# EAGLE design vco_module (EAGLE 6.1)
AUTH: Jeremy Ruhland; LAST_DATE_TIME: 4/29/2014; VER: 1.0
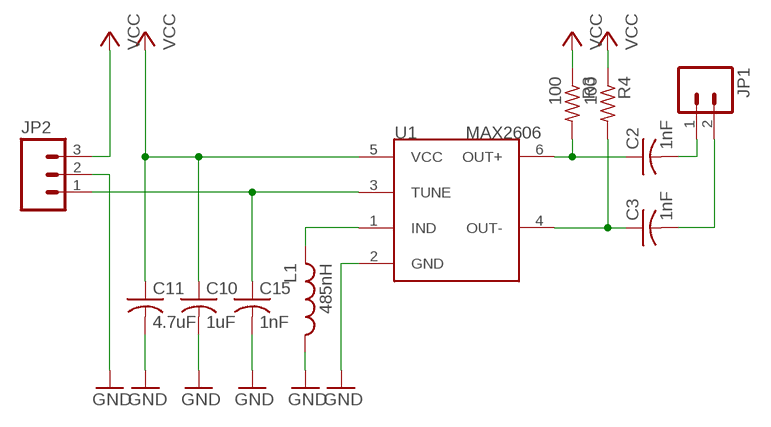
[diagram p0: schematic, sheet 1]

## Parts
C2  1nF  C-US050-025X075  [C050-025X075]
C3  1nF  C-US050-025X075  [C050-025X075]
C10  1uF  C-US050-025X075  [C050-025X075]
C11  4.7uF  C-US050-025X075  [C050-025X075]
C15  1nF  C-US050-025X075  [C050-025X075]
JP1  M023.5MM  [SCREWTERMINAL-3.5MM-2]
JP2  M03PTH  [1X03]
L1  485nH  L-US0204V  [0204V]
R3  100  R-US_0207/10  [0207/10]
R4  100  R-US_0207/10  [0207/10]
U1  MAX2606  [SOT23-6L]

## Nets
GND: C10.2 C11.2 C15.2 JP2.2 L1.1 U1.2(GND)
N$24: L1.2 U1.1(IND)
N$33: C2.1 R3.2 U1.6(OUT+)
N$35: C3.1 R4.2 U1.4(OUT-)
N$39: C2.2 JP1.1
N$52: C3.2 JP1.2
SIGNAL: C15.1 JP2.1 U1.3(TUNE)
VCC: C10.1 C11.1 JP2.3 R3.1 R4.1 U1.5(VCC)

## Library data of the parts
C2 C3 C10 C11 C15 = adafruit:C-US: CAPACITOR, American symbol
JP1 = sparkfun:M02: Header 2 Standard 2-pin 0.1" header. Use with straight break away headers (SKU : PRT-00116), right angle break away headers (PRT-00553), swiss pins (PRT-00743), machine pins (PRT-00117), and female headers (PRT-00115). Molex polarized connector foot print use with SKU : PRT-08233 with associated crimp pins and housings.
JP2 = sparkfun:M03: Header 3 Standard 3-pin 0.1" header. Use with straight break away headers (SKU : PRT-00116), right angle break away headers (PRT-00553), swiss pins (PRT-00743), machine pins (PRT-00117), and female headers (PRT-00115). Molex polarized connector foot print use with SKU : PRT-08232 with associated crimp pins and housings.
L1 = resistor:L-US: INDUCTOR, American symbol
R3 R4 = adafruit:R-US_: RESISTOR, American symbol
U1 = maxim:MAX2606

## Board
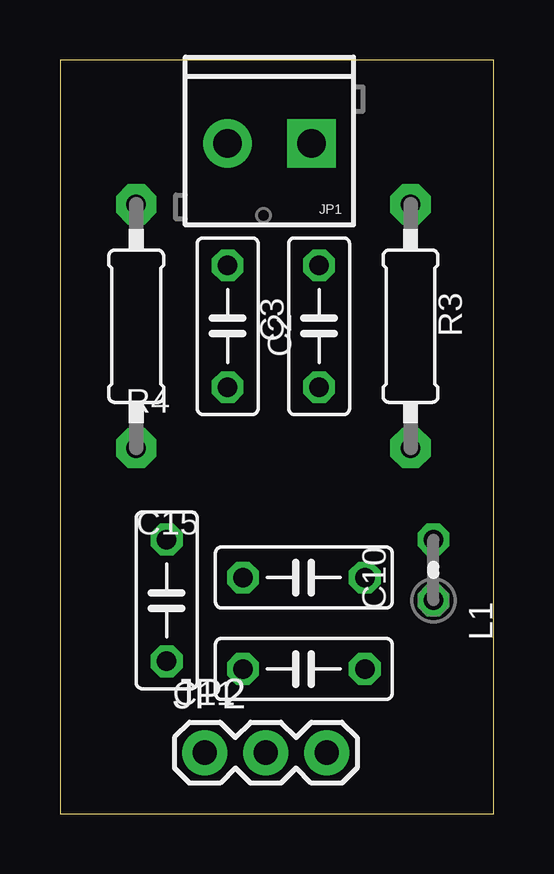
[diagram p1: board, top side]
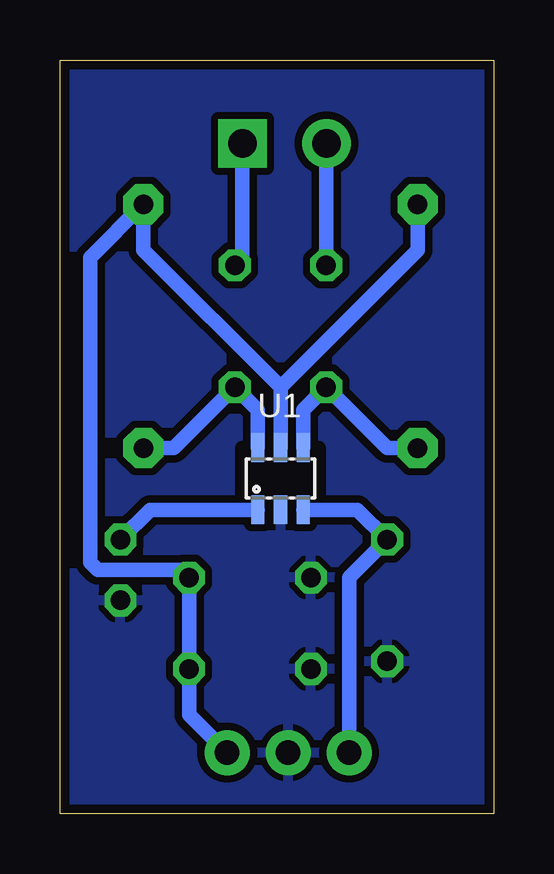
[diagram p2: board, bottom side, seen from below]

Size 18.08 x 31.42 mm. Coordinates in mm from the lower left corner, seen from the top.
Outline: 0,0 18.08,0 18.08,31.42 0,31.42 0,0
Copper layers (1*16): Top 0.035559375mm / dielectric 1.501140625mm / Bottom 0.035559375mm
Design rules: minimum track width 10mil, minimum drill 15mil, track to track 6mil, track to pad 6mil, pad to pad 6mil, via to via 6mil, smd to smd 6mil, copper to edge 15mil, drill to drill 8mil, minimum pad ring 10mil, minimum via ring 8mil, stop-mask expansion 4mil, vias tented up to drill 0mil, thermal gap 10mil
bRestrict: area 7.3,12.7 to 10.5,15.2

### Footprints (pad centres in the part's own frame; a part is rotated, then mirrored left to right if it is on the bottom)
C050-025X075 = drill 0.813 octagon: 1 -2.54,0; 2 2.54,0
SCREWTERMINAL-3.5MM-2 = drill 1.2 pad 2.032 square: 1 0,0 | drill 1.2 pad 2.032: 2 3.5,0
1X03 = drill 1.016 pad 1.88: 1 0,0; 2 2.54,0; 3 5.08,0
0204V = drill 0.813 octagon: 1 -1.27,0; 2 1.27,0
0207/10 = drill 0.813 pad 1.676 octagon: 1 -5.08,0; 2 5.08,0
SOT23-6L = smd 0.55 x 1.2: 1 -0.95,-1.3; 2 0,-1.3; 3 0.95,-1.3; 4 0.95,1.3; 5 0,1.3; 6 -0.95,1.3

### Placement (x,y rotation side)
C2  10.79,20.32 90 top
C3  6.99,20.32 90 top
C10  10.16,9.84 180 top
C11  10.16,6.03 180 top
C15  4.45,8.89 270 top
JP1  10.48,27.94 180 top
JP2  6.03,2.54 0 top
L1  15.56,10.16 90 top
R3  14.61,20.32 270 top
R4  3.17,20.32 270 top
U1  8.89,13.97 0 bottom

### Tracks (layer width: path | path; a pad name or v marks a point on that pad's centre or on a via)
GND
  pour Bottom (isolate 0.305): 0.32,0 0.32,31.75 18.1,31.75 18.1,0
N$1
  pour Bottom (isolate 0.305): 0,31.75 17.78,31.75 17.78,0 0,0
N$24
  Bottom 0.61: U1.1 14.32,12.67 L1.2
N$33
  Bottom 0.61: U1.6 9.84,16.82 C2.1 13.34,15.24 R3.2
N$35
  Bottom 0.61: U1.4 7.94,16.82 C3.1 4.45,15.24 R4.2
N$39
  Bottom 0.61: JP1.1 10.48,23.18 C2.2
N$52
  Bottom 0.61: JP1.2 6.98,22.87 C3.2
SIGNAL
  Bottom 0.61: U1.3 5.68,12.67 C15.1 6.03,9.84 JP2.1
VCC
  Bottom 0.61: U1.5 8.89,17.78 | 8.89,17.78 3.17,23.5 R4.1 | 8.89,17.78 14.61,23.5 R3.1 16.83,23.18 16.83,10.48 16.51,10.16 13.02,10.16 C10.1 C11.1 12.7,4.13 JP2.3